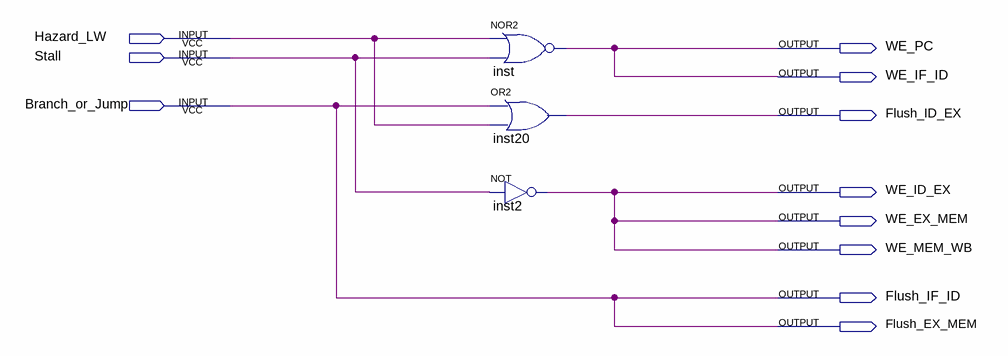
[diagram p0: schematic sheet]
// Quartus schematic ControleNopsAndStalls.bdf as structural Verilog: 3 symbols, 11 pins
module ControleNopsAndStalls (
  input  Hazard_LW,
  input  Stall,
  input  Branch_or_Jump,
  output WE_PC,
  output WE_IF_ID,
  output Flush_ID_EX,
  output WE_ID_EX,
  output WE_EX_MEM,
  output WE_MEM_WB,
  output Flush_IF_ID,
  output Flush_EX_MEM
);

  nor inst (WE_IF_ID, Hazard_LW, Stall);
  or inst20 (Flush_ID_EX, Branch_or_Jump, Hazard_LW);
  not inst2 (WE_EX_MEM, Stall);

  assign Flush_EX_MEM = Branch_or_Jump;
  assign Flush_IF_ID = Branch_or_Jump;
  assign WE_ID_EX = WE_EX_MEM;
  assign WE_MEM_WB = WE_EX_MEM;
  assign WE_PC = WE_IF_ID;
endmodule
